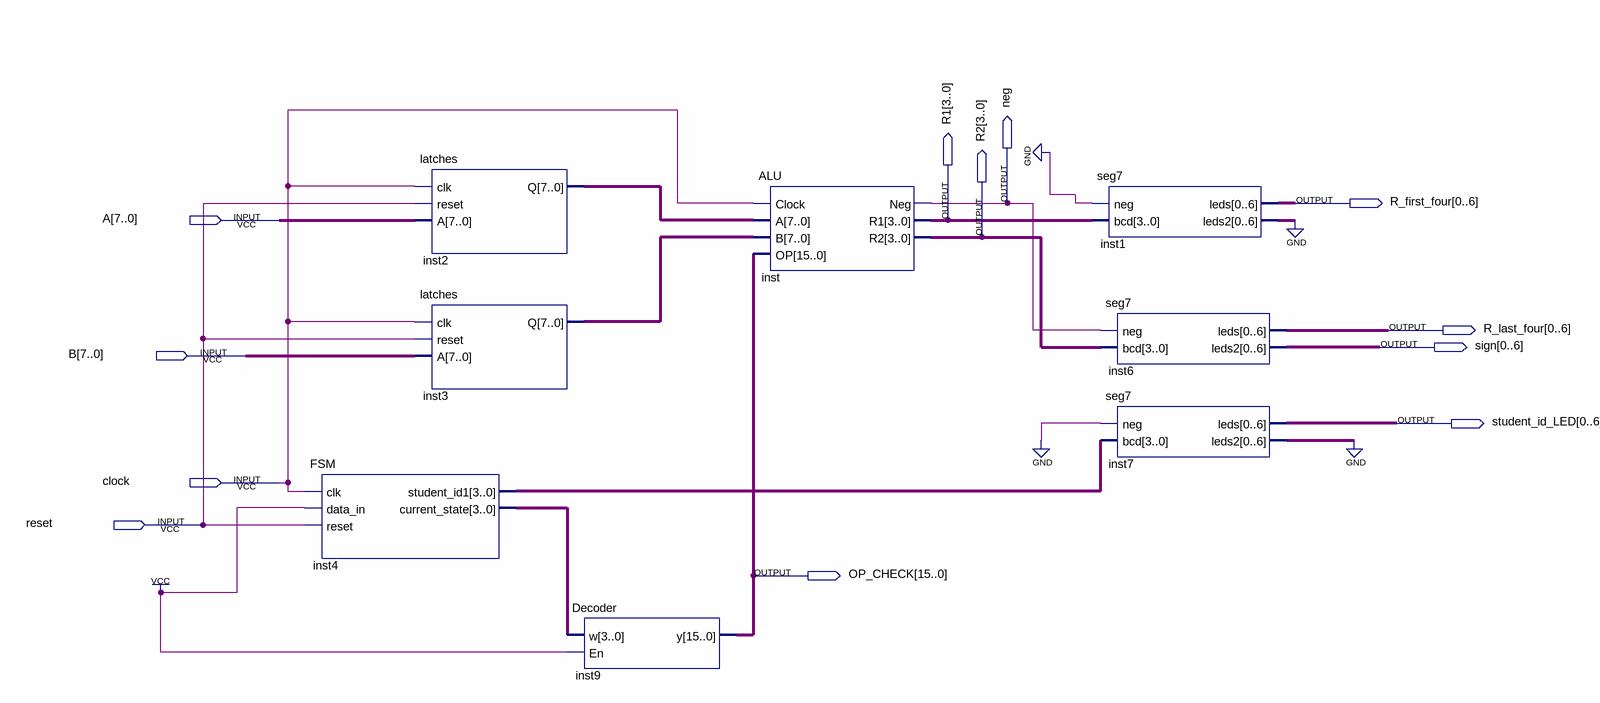
[diagram p0: schematic sheet]
// Quartus schematic general-purpose-ALU.bdf as structural Verilog: 8 symbols, 12 pins
module \general-purpose-ALU  (
  input  [7:0] A,
  input  [7:0] B,
  input  clock,
  input  reset,
  output neg,
  output [0:6] R_first_four,
  output [3:0] R1,
  output [3:0] R2,
  output [0:6] R_last_four,
  output [0:6] sign,
  output [0:6] student_id_LED,
  output [15:0] OP_CHECK
);

  wire [3:0] inst4_current_state, inst4_student_id1;
  wire [6:0] inst1_leds2, inst7_leds2;
  wire [7:0] inst2_q, inst3_q;

  FSM inst4 (
    .clk(clock), .data_in(1'b1), .reset(reset), .student_id1(inst4_student_id1),
    .current_state(inst4_current_state));
  latches inst2 (.clk(clock), .reset(reset), .A(A), .Q(inst2_q));
  latches inst3 (.clk(clock), .reset(reset), .A(B), .Q(inst3_q));
  Decoder inst9 (.w(inst4_current_state), .En(1'b1), .y(OP_CHECK));
  ALU inst (.Clock(clock), .A(inst2_q), .B(inst3_q), .OP(OP_CHECK), .Neg(neg), .R1(R1), .R2(R2));
  seg7 inst1 (.neg(1'b0), .bcd(R1), .leds(R_first_four), .leds2(inst1_leds2));
  seg7 inst6 (.neg(neg), .bcd(R2), .leds(R_last_four), .leds2(sign));
  seg7 inst7 (.neg(1'b0), .bcd(inst4_student_id1), .leds(student_id_LED), .leds2(inst7_leds2));
  // also tied to GND on the sheet: {inst1_leds2[0], inst1_leds2[1], inst1_leds2[2], inst1_leds2[3], inst1_leds2[4], inst1_leds2[5], inst1_leds2[6], inst7_leds2[0], inst7_leds2[1], inst7_leds2[2], inst7_leds2[3], inst7_leds2[4], inst7_leds2[5], inst7_leds2[6]}
endmodule
